# Altium project control-panel.PrjPCB
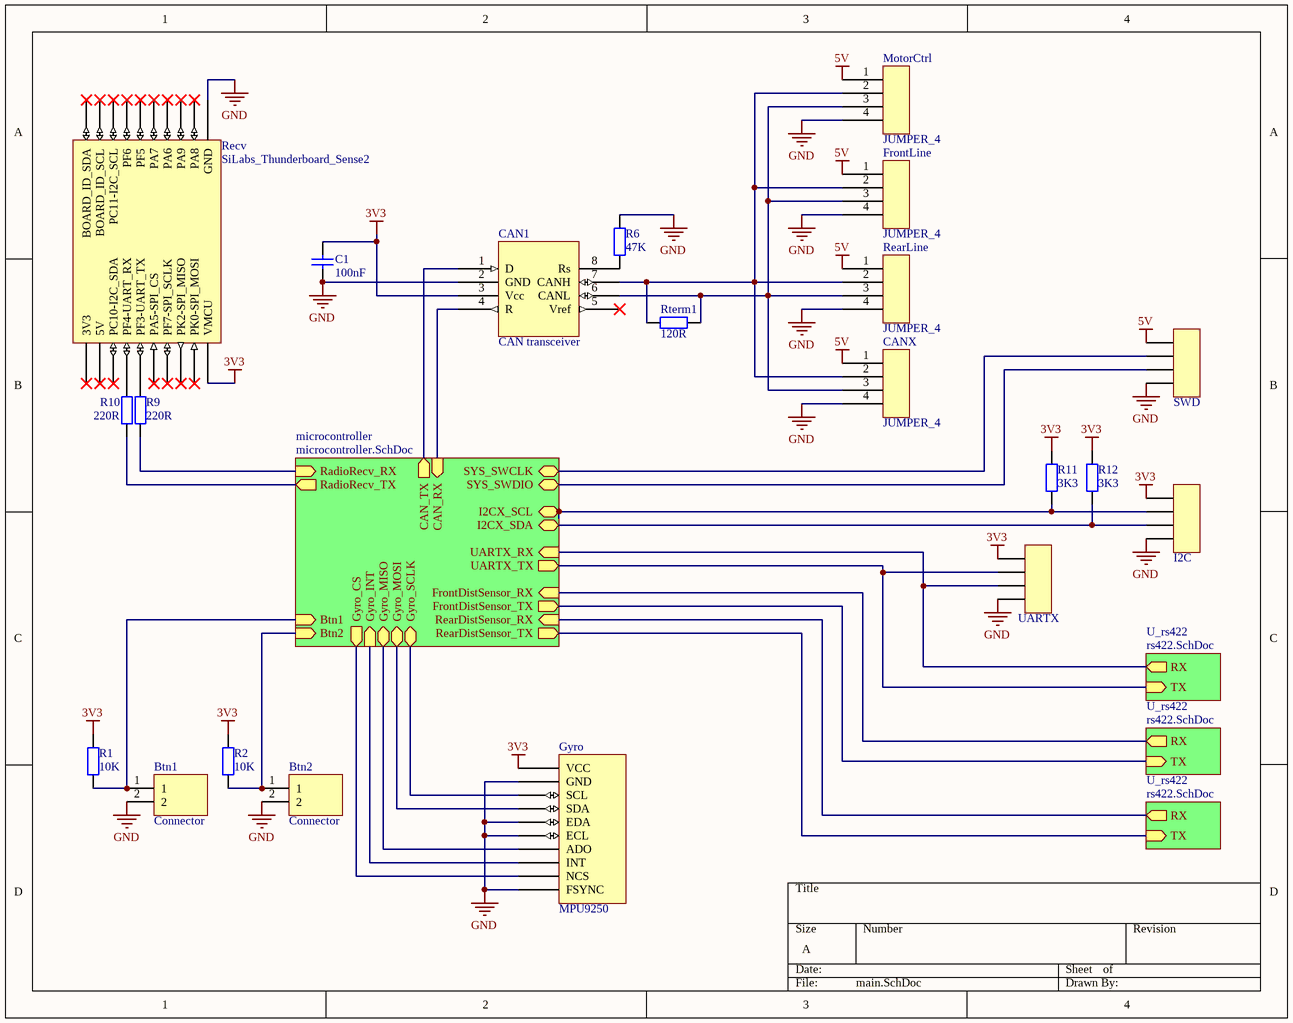
[diagram p0: main.SchDoc]
3 sheets, 53 parts. Net scope: hierarchical (ports join the sheet entries above them; power ports are global).
Board file: main.PcbDoc
Sheets:
  main.SchDoc
    U_rs422 = rs422.SchDoc
    U_rs422 = rs422.SchDoc
    U_rs422 = rs422.SchDoc
    microcontroller = microcontroller.SchDoc

## Sheet main.SchDoc
size A

### Parts
Btn1  Connector  [FP_CONN2_TUSKE_254MM]
Btn2  Connector  [FP_CONN2_TUSKE_254MM]
C1  100nF  [FP_0805_CAP_085]
CAN1  CAN transceiver  [SOIC-8]
CANX  JUMPER_4  [JUMPER_4]
FrontLine  JUMPER_4  [JUMPER_4]
Gyro  MPU9250  [MPU9250]
I2C  4-Pin Header  [4-Pin Header]  (value not drawn)
MotorCtrl  JUMPER_4  [JUMPER_4]
R1  10K  [FP_0805_RES]
R2  10K  [FP_0805_RES]
R6  47K  [FP_0805_RES]
R9  220R  [FP_0805_RES]
R10  220R  [FP_0805_RES]
R11  3K3  [FP_0805_RES]
R12  3K3  [FP_0805_RES]
RearLine  JUMPER_4  [JUMPER_4]
Recv  SiLabs_Thunderboard_Sense2  [SiLabs_Thunderbird_Sense2]
Rterm1  120R  [FP_0805_RES]
SWD  4-Pin Header  [4-Pin Header]  (value not drawn)
UARTX  4-Pin Header  [4-Pin Header]  (value not drawn)

### Sub-sheets
microcontroller = microcontroller.SchDoc: Btn1 (in), Btn2 (in), RadioRecv_RX (in), RadioRecv_TX (out), Gyro_SCLK (bidir), Gyro_MISO (bidir), Gyro_MOSI (bidir), Gyro_CS (out), Gyro_INT (in), UARTX_TX (out), I2CX_SDA (bidir), CAN_RX (in), CAN_TX (out), SYS_SWCLK (bidir), I2CX_SCL (bidir), UARTX_RX (in), SYS_SWDIO (bidir), FrontDistSensor_TX (out), RearDistSensor_RX (in), RearDistSensor_TX (out), FrontDistSensor_RX (in)
U_rs422 = rs422.SchDoc: RX (out), TX (in)
U_rs422 = rs422.SchDoc: RX (out), TX (in)
U_rs422 = rs422.SchDoc: RX (out), TX (in)

### Nets
3V3: C1.1 CAN1.3(Vcc) Gyro.VCC I2C.1 R1.2 R2.2 R11.2 R12.2 Recv.2(VMCU) UARTX.1
5V: CANX.1 FrontLine.1 MotorCtrl.1 RearLine.1 SWD.1
GND: Btn1.2 Btn2.2 C1.2 CAN1.2(GND) CANX.4 FrontLine.4 Gyro.ECL Gyro.EDA Gyro.FSYNC Gyro.GND I2C.4 MotorCtrl.4 R6.2 RearLine.4 Recv.1(GND) SWD.4 UARTX.4
Net1_14: sheet U_rs422/TX, sheet microcontroller/FrontDistSensor_TX
Net1_15: sheet U_rs422/RX, sheet microcontroller/FrontDistSensor_RX
Net1_22: Gyro.ADO ; sheet microcontroller/Gyro_MISO
Net1_23: Gyro.SDA ; sheet microcontroller/Gyro_MOSI
Net1_25: R9.1 ; sheet microcontroller/RadioRecv_RX
Net1_26: Gyro.INT ; sheet microcontroller/Gyro_INT
Net1_29: R10.1 ; sheet microcontroller/RadioRecv_TX
Net1_37: UARTX.2 ; sheet U_rs422/TX, sheet microcontroller/UARTX_TX
Net1_38: UARTX.3 ; sheet U_rs422/RX, sheet microcontroller/UARTX_RX
Net1_40: Btn2.1 R2.1 ; sheet microcontroller/Btn2
Net1_41: I2C.2 R11.1 ; sheet microcontroller/I2CX_SCL
Net1_44: CAN1.4(R) ; sheet microcontroller/CAN_RX
Net1_45: CAN1.1(D) ; sheet microcontroller/CAN_TX
Net1_46: SWD.3 ; sheet microcontroller/SYS_SWDIO
Net1_49: SWD.2 ; sheet microcontroller/SYS_SWCLK
Net1_51: Btn1.1 R1.1 ; sheet microcontroller/Btn1
Net1_53: sheet U_rs422/TX, sheet microcontroller/RearDistSensor_TX
Net1_54: sheet U_rs422/RX, sheet microcontroller/RearDistSensor_RX
Net1_55: Gyro.SCL ; sheet microcontroller/Gyro_SCLK
Net1_56: I2C.3 R12.1 ; sheet microcontroller/I2CX_SDA
Net1_57: Gyro.NCS ; sheet microcontroller/Gyro_CS
NetCAN1_6: CAN1.6(CANL) CANX.3 FrontLine.3 MotorCtrl.3 RearLine.3 Rterm1.2
NetCAN1_7: CAN1.7(CANH) CANX.2 FrontLine.2 MotorCtrl.2 RearLine.2 Rterm1.1
NetCAN1_8: CAN1.8(Rs) R6.1
NetR9_2: R9.2 Recv.12(PF3-UART_TX)
NetR10_2: R10.2 Recv.14(PF4-UART_RX)

Not connected (* = marked no-connect by the designer): CAN1 5(Vref)*; Recv 3(PA8)* 4(PK0-SPI_MOSI)* 5(PA9)* 6(PK2-SPI_MISO)* 7(PA6)* 8(PF7-SPI_SCLK)* 9(PA7)* 10(PA5-SPI_CS)* 11(PF5)* 13(PF6)* 15(PC11-I2C_SCL)* 16(PC10-I2C_SDA)* 17(BOARD_ID_SCL)* 18(5V)* 19(BOARD_ID_SDA)* 20(3V3)*

### Library data of the parts
Btn1 Btn2 = Connector_2pin: 2pin connector
C1 = CAP 100nF: Capacitor; Tolerance: +80%/-20%; Voltage: 25V; Reference: 1759167; Name: SMD Multilayer Ceramic Capacitor, 0805; Supplier: Farnell; Value: 100nF
CAN1 = SN65HVD230
R1 R2 = RES 10K: Resistor; Tolerance: 5%; Power: 125mW; Name: YAGEO (PHYCOMP)  RC0805JR-0710KL  SMD Chip Resistor, Thick Film, 10 kohm; Reference: 9234136; Supplier: Farnell; Value: 10K
R6 = RES 47K: Resistor; Tolerance: 5%; Power: 125mW; Name: YAGEO (PHYCOMP)  RC0805JR-0747KL  SMD Chip Resistor, Thick Film, 47 kohm; Reference: 9234217; Supplier: Farnell; Value: 47K
R9 R10 = RES 220R: Resistor; Tolerance: 5%; Power: 125mW; Name: YAGEO (PHYCOMP)  RC0805JR-07220RL  SMD Chip Resistor, Thick Film, 220 ohm; Reference: 9233920; Supplier: Farnell; Value: 220R
R11 R12 = RES 3K3: Resistor; Tolerance: 1%; Power: 125mW; Name: YAGEO (PHYCOMP)  RC0805FR-073K3L  SMD Chip Resistor, Thick Film, 3.3 kohm, 150 V, 0805 [2012 Metric], 125 mW, ± 1%, RC Series; Reference: 9237682; Supplier: Farnell; Value: 3K3
Recv = SiLabs_Thunderboard_Sense2: Radio transmitter/receiver
Rterm1 = RES 120R: Resistor; Tolerance: 5%; Power: 125mW; Name: YAGEO (PHYCOMP)  RC0805JR-07120RL  SMD Chip Resistor, Thick Film, 120 ohm; Reference: 9233890; Supplier: Farnell; Value: 120R

## Sheet rs422.SchDoc
size A
Used 3 times, as channels U_rs422, U_rs422, U_rs422. Parts and nets are listed once, with the designators drawn on the sheet.
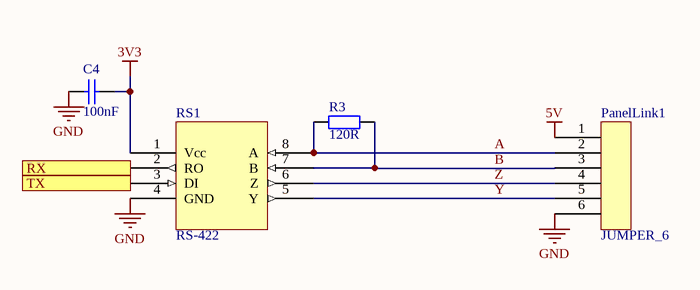
[diagram p1: rs422.SchDoc]

### Parts
C4  100nF  [FP_0805_CAP_085]
PanelLink1  JUMPER_6  [JUMPER_6]
R3  120R  [FP_0805_RES]
RS1  RS-422  [NSOIC-8]

### Ports
RX (out), TX (in)

### Nets
3V3: C4.1 RS1.1(Vcc)
5V: PanelLink1.1
GND: C4.2 PanelLink1.6 RS1.4(GND)
A: PanelLink1.2 R3.1 RS1.8(A)
B: PanelLink1.3 R3.2 RS1.7(B)
RX: RS1.2(RO) ; port RX
TX: RS1.3(DI) ; port TX
Y: PanelLink1.5 RS1.5(Y)
Z: PanelLink1.4 RS1.6(Z)

### Channels
U_rs422: designators C4=C4#1 PanelLink1=FrontDistSensor R3=R3#1 RS1=RS422#1; ports RX=Net1_15 TX=Net1_14
U_rs422: designators C4=C4#2 PanelLink1=RearDistSensor R3=R3#2 RS1=RS422#2; ports RX=Net1_54 TX=Net1_53
U_rs422: designators C4=C4#3 PanelLink1=PanelLinkX R3=R3#3 RS1=RS422#3; ports RX=Net1_38 TX=Net1_37

### Library data of the parts
C4 = CAP 100nF: as C1 on sheet main; Supplier: Farnell; Value: 100nF
R3 = RES 120R: as Rterm1 on sheet main; Supplier: Farnell; Value: 120R
RS1 = ISL83071: RS-422 transceiver 3V3

## Sheet microcontroller.SchDoc
size A
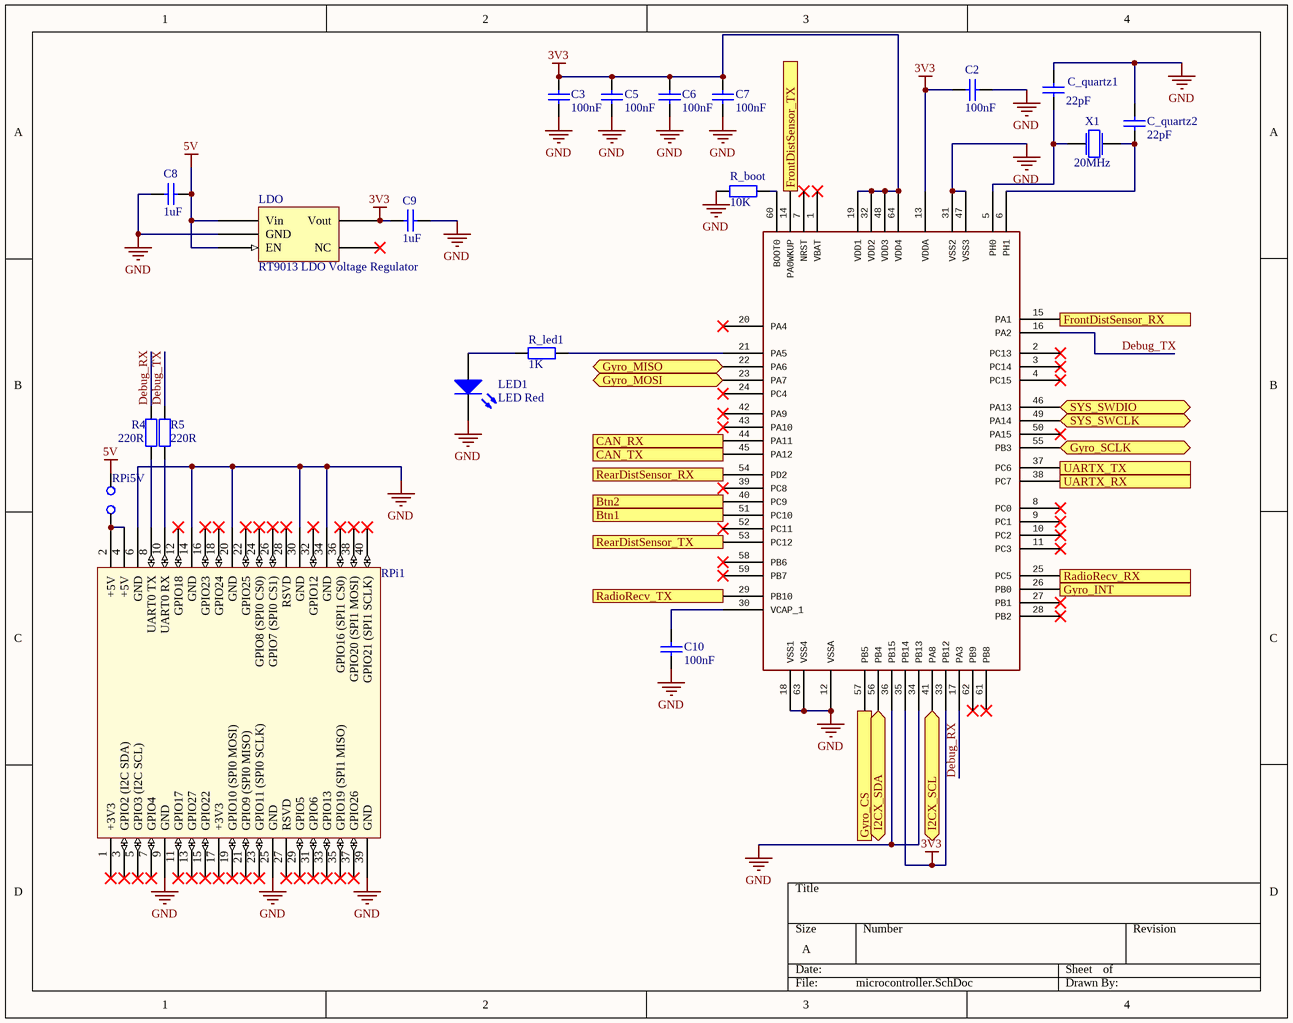
[diagram p2: microcontroller.SchDoc]

### Parts
1  64-pin STM32F4 chip with symbol for Foxcar Control Board v1.  [LQFP64]  (value not drawn)
C2  100nF  [FP_0805_CAP_085]
C3  100nF  [FP_0805_CAP_085]
C5  100nF  [FP_0805_CAP_085]
C6  100nF  [FP_0805_CAP_085]
C7  100nF  [FP_0805_CAP_085]
C8  1uF  [FP_0805_CAP_085]
C9  1uF  [FP_0805_CAP_085]
C10  100nF  [FP_0805_CAP_085]
C_quartz1  22pF  [FP_0805_CAP_085]
C_quartz2  22pF  [FP_0805_CAP_085]
LDO  RT9013 LDO Voltage Regulator  [RT9013_SOT23]
LED1  LED Red  [FP_0805_LED_RED]
R4  220R  [FP_0805_RES]
R5  220R  [FP_0805_RES]
R_boot  10K  [FP_0805_RES]
R_led1  1K  [FP_0805_RES]
RPi1  RPI GPIO Connector  [rpi]  (value not drawn)
RPi5V  (no value)  [JUMPER_2]
X1  20MHz  [FP_CRYSTAL_HC49_SMD]

### Ports
Btn1 (in), Btn2 (in), CAN_RX (in), CAN_TX (out), FrontDistSensor_RX (in), FrontDistSensor_TX (out), Gyro_CS (out), Gyro_INT (in), Gyro_MISO (bidir), Gyro_MOSI (bidir), Gyro_SCLK (bidir), I2CX_SCL (bidir), I2CX_SDA (bidir), RadioRecv_RX (in), RadioRecv_TX (out), RearDistSensor_RX (in), RearDistSensor_TX (out), SYS_SWCLK (bidir), SYS_SWDIO (bidir), UARTX_RX (in), UARTX_TX (out)

### Nets
3V3: 1.13(VDDA) 1.19(VDD1) 1.32(VDD2) 1.33(PB12) 1.35(PB14) 1.48(VDD3) 1.64(VDD4) C2.2 C3.2 C5.2 C6.2 C7.2 C9.1 LDO.Vout
5V: C8.2 LDO.EN LDO.Vin RPi5V.2(C2)
GND: 1.12(VSSA) 1.18(VSS1) 1.31(VSS2) 1.34(PB13) 1.36(PB15) 1.47(VSS3) 1.63(VSS4) C2.1 C3.1 C5.1 C6.1 C7.1 C8.1 C9.2 C10.1 C_quartz1.1 C_quartz2.1 LDO.GND LED1.2(K) R_boot.1 RPi1.6(GND) RPi1.9(GND) RPi1.14(GND) RPi1.20(GND) RPi1.25(GND) RPi1.30(GND) RPi1.34(GND) RPi1.39(GND)
Debug_RX: 1.17(PA3) R4.2
Debug_TX: 1.16(PA2) R5.2
Net1_5: 1.5(PH0) C_quartz1.2 X1.1
Net1_6: 1.6(PH1) C_quartz2.2 X1.2
Net1_14: 1.14(PA0WKUP) ; port FrontDistSensor_TX
Net1_15: 1.15(PA1) ; port FrontDistSensor_RX
Net1_21: 1.21(PA5) R_led1.1
Net1_22: 1.22(PA6) ; port Gyro_MISO
Net1_23: 1.23(PA7) ; port Gyro_MOSI
Net1_25: 1.25(PC5) ; port RadioRecv_RX
Net1_26: 1.26(PB0) ; port Gyro_INT
Net1_29: 1.29(PB10) ; port RadioRecv_TX
Net1_30: 1.30(VCAP_1) C10.2
Net1_37: 1.37(PC6) ; port UARTX_TX
Net1_38: 1.38(PC7) ; port UARTX_RX
Net1_40: 1.40(PC9) ; port Btn2
Net1_41: 1.41(PA8) ; port I2CX_SCL
Net1_44: 1.44(PA11) ; port CAN_RX
Net1_45: 1.45(PA12) ; port CAN_TX
Net1_46: 1.46(PA13) ; port SYS_SWDIO
Net1_49: 1.49(PA14) ; port SYS_SWCLK
Net1_51: 1.51(PC10) ; port Btn1
Net1_53: 1.53(PC12) ; port RearDistSensor_TX
Net1_54: 1.54(PD2) ; port RearDistSensor_RX
Net1_55: 1.55(PB3) ; port Gyro_SCLK
Net1_56: 1.56(PB4) ; port I2CX_SDA
Net1_57: 1.57(PB5) ; port Gyro_CS
Net1_60: 1.60(BOOT0) R_boot.2
NetLED1_1: LED1.1(A) R_led1.2
NetR4_1: R4.1 RPi1.8(UART0_TX)
NetR5_1: R5.1 RPi1.10(UART0_RX)
NetRPi1_2: RPi1.2(+5V) RPi1.4(+5V) RPi5V.1(C1)

Not connected (* = marked no-connect by the designer): 1 1(VBAT)* 2(PC13)* 3(PC14)* 4(PC15)* 7(NRST)* 8(PC0)* 9(PC1)* 10(PC2)* 11(PC3)* 20(PA4)* 24(PC4)* 27(PB1)* 28(PB2)* 39(PC8)* 42(PA9)* 43(PA10)* 50(PA15)* 52(PC11)* 58(PB6)* 59(PB7)* 61(PB8)* 62(PB9)*; LDO NC*; RPi1 1(+3V3)* 3(GPIO2_(I2C_SDA))* 5(GPIO3_(I2C_SCL))* 7(GPIO4)* 11(GPIO17)* 12(GPIO18)* 13(GPIO27)* 15(GPIO22)* 16(GPIO23)* 17(+3V3)* 18(GPIO24)* 19(GPIO10_(SPI0_MOSI))* 21(GPIO9_(SPI0_MISO))* 22(GPIO25)* 23(GPIO11_(SPI0_SCLK))* 24(GPIO8_(SPI0_CS0))* 26(GPIO7_(SPI0_CS1))* 27(RSVD)* 28(RSVD)* 29(GPIO5)* 31(GPIO6)* 32(GPIO12)* 33(GPIO13)* 35(GPIO19_(SPI1_MISO))* 36(GPIO16_(SPI1_CS0))* 37(GPIO26)* 38(GPIO20_(SPI1_MOSI))* 40(GPIO21_(SPI1_SCLK))*

### Library data of the parts
1 = STM32F4R_64PIN_FOXCAR: GateName_1: G$1; SymbolName_1: STM32F4_64PINS_FOXCARV1; LibraryName: stm32f4; DeviceSetName: STM32F4R_64PIN_FOXCAR; Package: LQFP64
C2 C3 C5-C7 C10 = CAP 100nF: as C1 on sheet main; Supplier: Farnell; Value: 100nF
C8 C9 = CAP 1uF: Capacitor; Tolerance: +80%/-20%; Voltage: 25V; Reference: 1828853; Name: SMD Multilayer Ceramic Capacitor, 0805; Supplier: Farnell; Value: 1uF
C_quartz1 C_quartz2 = CAP 22pF: Capacitor; Tolerance: 5%; Voltage: 50V; Reference: 1759195; Name: SMD Multilayer Ceramic Capacitor, 0805; Supplier: Farnell; Value: 22pF
LDO = RT9013: LDO Voltage Regulator
LED1 = LED Red: Red LED; pin to pad: 1>A 2>K; U_fw: 1.85V; I_max: 20mA; Reference: 1581239; Name: MULTICOMP  MCL-S270SRC  LED, Red, SMD, 1.25mm x 1.4mm, 20 mA, 1.85 V, 643 nm; Wavelength: 643nm; Supplier: Farnell
R4 R5 = RES 220R: as R9 on sheet main; Supplier: Farnell; Value: 220R
R_boot = RES 10K: as R1 on sheet main; Supplier: Farnell; Value: 10K
R_led1 = RES 1K: Resistor; Tolerance: 5%; Power: 125mW; Name: YAGEO (PHYCOMP)  RC0805JR-071KL  SMD Chip Resistor, Thick Film, 1 kohm; Reference: 9234004; Supplier: Farnell; Value: 1K
RPi1 = rpi connector: GPIO Header for Raspberry Pi A+/B+/Pi 2/Pi 3 - 2x20; Manufacturer: SparkFun Electronics; Manufacturer Part Number: PRT-14017; Nils Minor: author; nilsminor@web.de: mail; RoHS: RoHS Compliant; Category: Development Boards, Kits, Programmers; Stock 1: 150; Pricing 1: 1=1.84 (EUR); Part Status: Active; Accessory Type: Connector; For Use With/Related Products: Raspberry Pi; ComponentLink1URL: https://cdn.sparkfun.com/datasheets/Dev/RaspberryPi/12313.pdf; ComponentLink1Description: https://cdn.sparkfun.com/datasheets/Dev/RaspberryPi/12313.pdf; Supplier 1: Digi-Key; Supplier Part Number 1: 1568-1462-ND
RPi5V = JUMPER_2
X1 = Crystal: Quarz Crystal; Value: 8MHz

## Nets that join several sheets
3V3: main (10 pins), U_rs422 (C4#1.1 RS422#1.1), U_rs422 (C4#2.1 RS422#2.1), U_rs422 (C4#3.1 RS422#3.1), microcontroller (14 pins)
5V: main (5 pins), U_rs422 (FrontDistSensor.1), U_rs422 (RearDistSensor.1), U_rs422 (PanelLinkX.1), microcontroller (C8.2 LDO.EN LDO.Vin RPi5V.2)
GND: main (17 pins), U_rs422 (C4#1.2 FrontDistSensor.6 RS422#1.4), U_rs422 (C4#2.2 RearDistSensor.6 RS422#2.4), U_rs422 (C4#3.2 PanelLinkX.6 RS422#3.4), microcontroller (28 pins)
Net1_14: U_rs422 (RS422#1.3), microcontroller (1.14)
Net1_15: U_rs422 (RS422#1.2), microcontroller (1.15)
Net1_22: main (Gyro.ADO), microcontroller (1.22)
Net1_23: main (Gyro.SDA), microcontroller (1.23)
Net1_25: main (R9.1), microcontroller (1.25)
Net1_26: main (Gyro.INT), microcontroller (1.26)
Net1_29: main (R10.1), microcontroller (1.29)
Net1_37: main (UARTX.2), U_rs422 (RS422#3.3), microcontroller (1.37)
Net1_38: main (UARTX.3), U_rs422 (RS422#3.2), microcontroller (1.38)
Net1_40: main (Btn2.1 R2.1), microcontroller (1.40)
Net1_41: main (I2C.2 R11.1), microcontroller (1.41)
Net1_44: main (CAN1.4), microcontroller (1.44)
Net1_45: main (CAN1.1), microcontroller (1.45)
Net1_46: main (SWD.3), microcontroller (1.46)
Net1_49: main (SWD.2), microcontroller (1.49)
Net1_51: main (Btn1.1 R1.1), microcontroller (1.51)
Net1_53: U_rs422 (RS422#2.3), microcontroller (1.53)
Net1_54: U_rs422 (RS422#2.2), microcontroller (1.54)
Net1_55: main (Gyro.SCL), microcontroller (1.55)
Net1_56: main (I2C.3 R12.1), microcontroller (1.56)
Net1_57: main (Gyro.NCS), microcontroller (1.57)